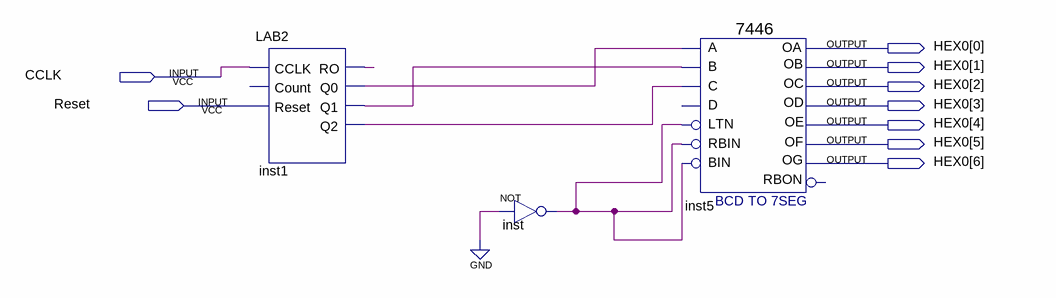
[diagram p0: schematic sheet]
// Quartus schematic 7segmod6.bdf as structural Verilog: 3 symbols, 9 pins
module \7segmod6  (
  input  CCLK,
  input  Reset,
  output [6:0] HEX0
);

  wire inst1_q0, inst1_q1, inst1_q2, inst1_ro, inst_out;

  LAB2 inst1 (.CCLK(CCLK), .Reset(Reset), .RO(inst1_ro), .Q0(inst1_q0), .Q1(inst1_q1), .Q2(inst1_q2));  // open: Count
  not inst (inst_out, 1'b0);
  \7446  inst5 (
    .C(inst1_q2), .B(inst1_q1), .LTN(inst_out), .A(inst1_q0), .RBIN(inst_out), .BIN(inst_out), .OC(HEX0[2]),
    .OD(HEX0[3]), .OE(HEX0[4]), .OA(HEX0[0]), .OB(HEX0[1]), .OF(HEX0[5]), .OG(HEX0[6]));  // open: D, RBON
endmodule
